# Altium schematic sheet Driver4BusV1.1.SchDoc: Adapterkarte 68-50polig mit Strobegenerator
size A2; PageSetup: Record=PageOptions|CenterHorizontal=True|CenterVertical=True|PrintScale=0.50|XCorrection=1.00|YCorrection=1.00|PrintKind=0|BorderSize=5000000|LeftOffset=0|BottomOffset=0|Orientation=2|PaperLength=2970|PaperWidth=2100|Scale=100|PaperSource=1|PrintQuality=-3|MediaType=1|DitherType=10|PaperKind=A4|PrintScaleMode=1
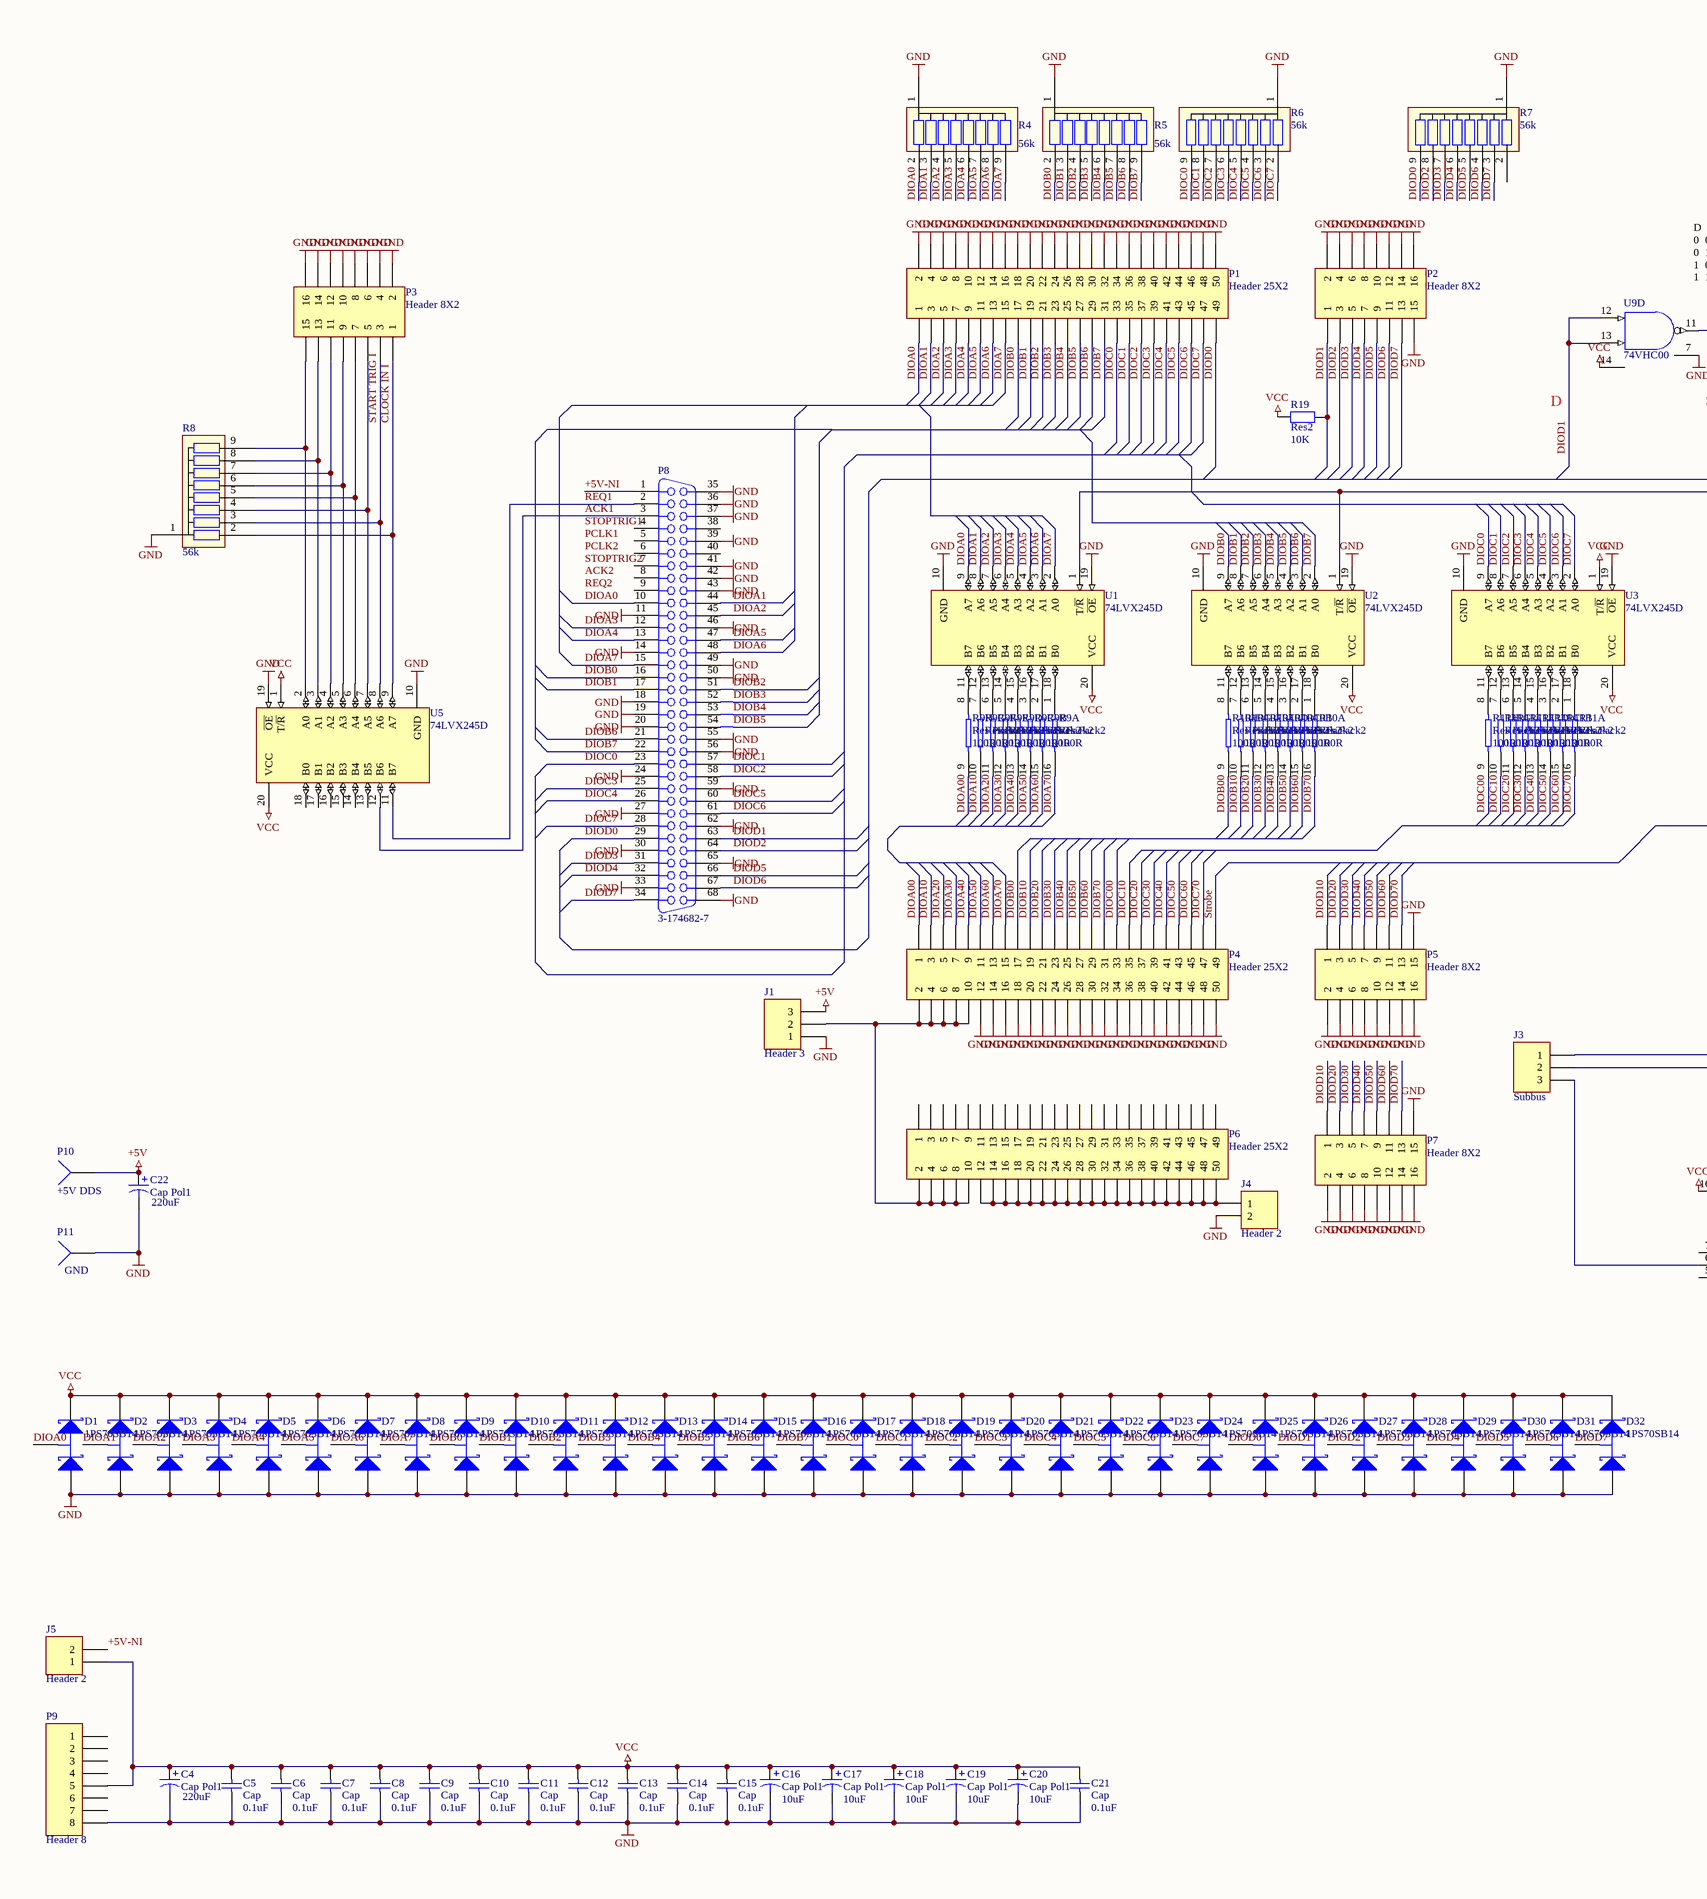
[diagram p0: Driver4BusV1.1.SchDoc, left]
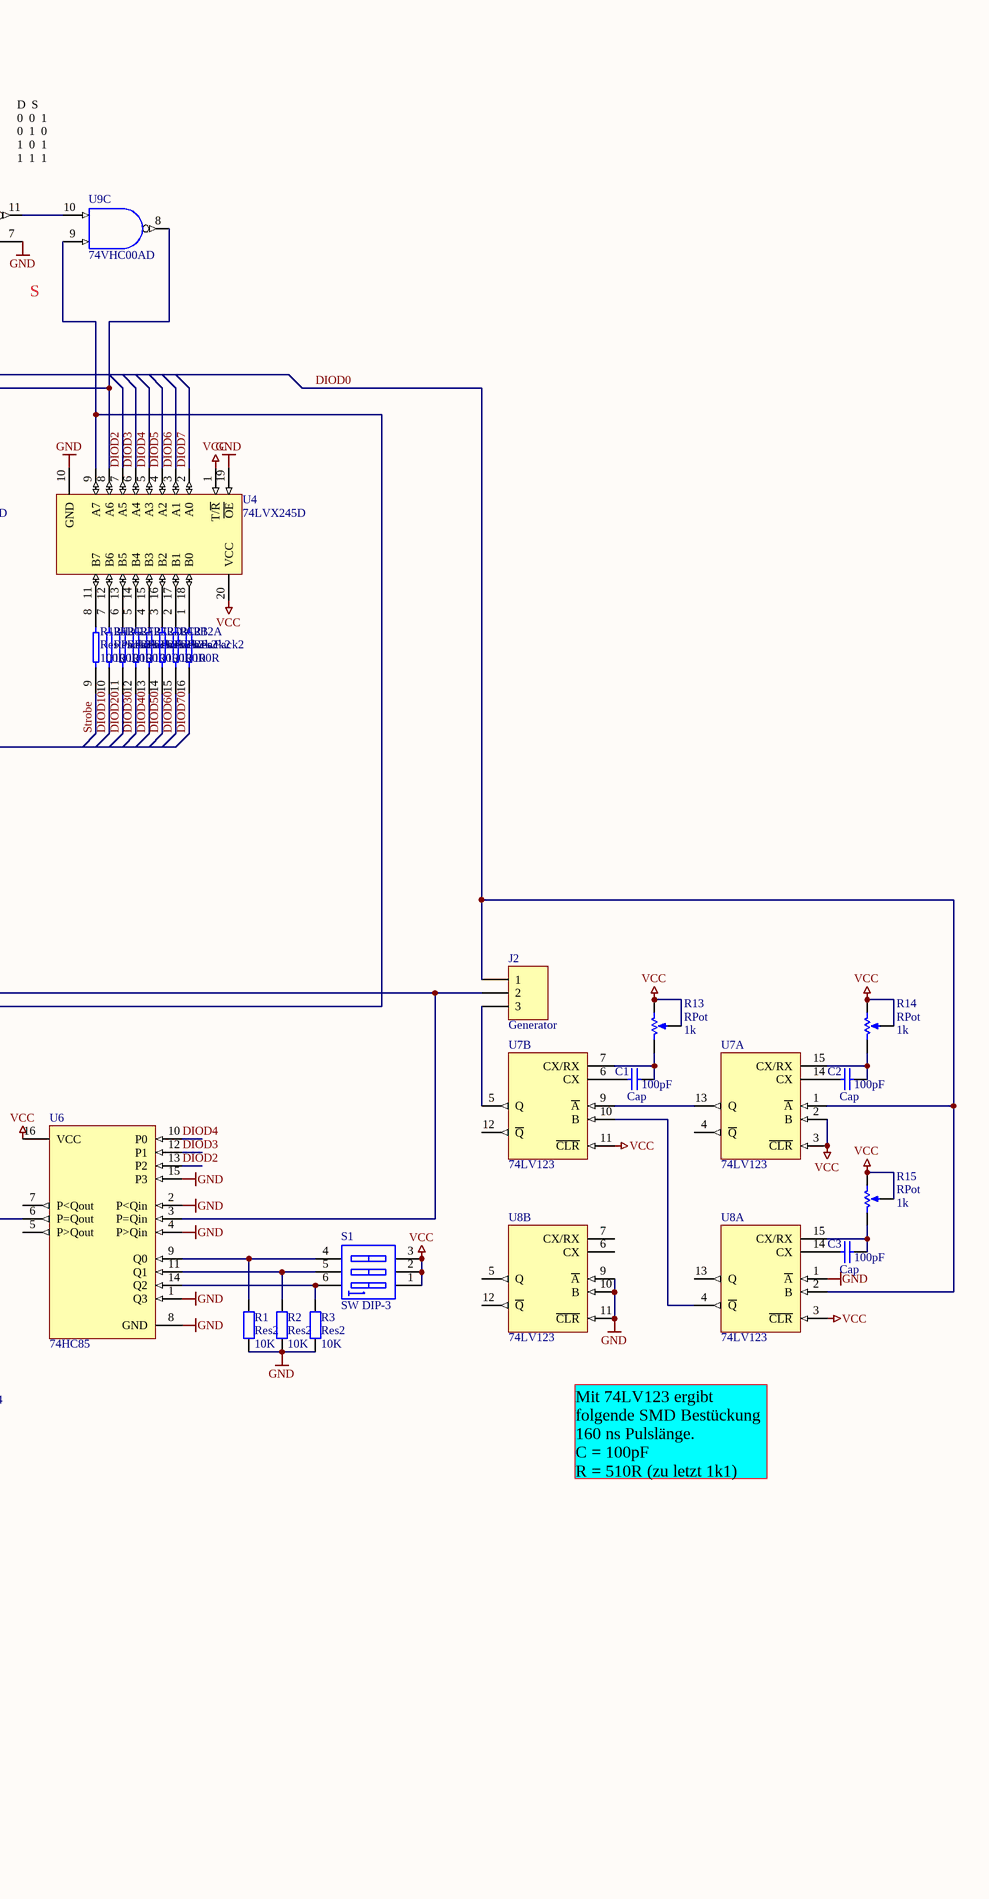
[diagram p1: Driver4BusV1.1.SchDoc, right]

## Parts
C1  Cap  value 100pF  [CAPC3216M]
C2  Cap  value 100pF  [CAPC3216M]
C3  Cap  value 100pF  [CAPC3216M]
C4  Cap Pol1  value 220uF  [ElkoSMD8]
C5  Cap  value 0.1uF  [CAPC3216M]
C6  Cap  value 0.1uF  [CAPC3216M]
C7  Cap  value 0.1uF  [CAPC3216M]
C8  Cap  value 0.1uF  [CAPC3216M]
C9  Cap  value 0.1uF  [CAPC3216M]
C10  Cap  value 0.1uF  [CAPC3216M]
C11  Cap  value 0.1uF  [CAPC3216M]
C12  Cap  value 0.1uF  [CAPC3216M]
C13  Cap  value 0.1uF  [CAPC3216M]
C14  Cap  value 0.1uF  [CAPC3216M]
C15  Cap  value 0.1uF  [CAPC3216M]
C16  Cap Pol1  value 10uF  [TC3528-1411]
C17  Cap Pol1  value 10uF  [TC3528-1411]
C18  Cap Pol1  value 10uF  [TC3528-1411]
C19  Cap Pol1  value 10uF  [TC3528-1411]
C20  Cap Pol1  value 10uF  [TC3528-1411]
C21  Cap  value 0.1uF  [CAPC3216M]
C22  Cap Pol1  value 220uF  [ElkoSMD8]
D1  1PS70SB14  [SOT323]
D2  1PS70SB14  [SOT323]
D3  1PS70SB14  [SOT323]
D4  1PS70SB14  [SOT323]
D5  1PS70SB14  [SOT323]
D6  1PS70SB14  [SOT323]
D7  1PS70SB14  [SOT323]
D8  1PS70SB14  [SOT323]
D9  1PS70SB14  [SOT323]
D10  1PS70SB14  [SOT323]
D11  1PS70SB14  [SOT323]
D12  1PS70SB14  [SOT323]
D13  1PS70SB14  [SOT323]
D14  1PS70SB14  [SOT323]
D15  1PS70SB14  [SOT323]
D16  1PS70SB14  [SOT323]
D17  1PS70SB14  [SOT323]
D18  1PS70SB14  [SOT323]
D19  1PS70SB14  [SOT323]
D20  1PS70SB14  [SOT323]
D21  1PS70SB14  [SOT323]
D22  1PS70SB14  [SOT323]
D23  1PS70SB14  [SOT323]
D24  1PS70SB14  [SOT323]
D25  1PS70SB14  [SOT323]
D26  1PS70SB14  [SOT323]
D27  1PS70SB14  [SOT323]
D28  1PS70SB14  [SOT323]
D29  1PS70SB14  [SOT323]
D30  1PS70SB14  [SOT323]
D31  1PS70SB14  [SOT323]
D32  1PS70SB14  [SOT323]
J1  Header 3  [HDR1X3]
J2  Generator  [HDR1X3]
J3  Subbus  [HDR1X3]
J4  Header 2  [RESC2012M]
J5  Header 2  [RESC2012M]
P1  Header 25X2  [HDR2X25]
P2  Header 8X2  [HDR2X8]
P3  Header 8X2  [HDR2X8]
P4  Header 25X2  [HDR2X25]
P5  Header 8X2  [HDR2X8]
P6  Header 25X2  [HDR2X25]
P7  Header 8X2  [HDR2X8]
P8  3-174682-7  [174225-5]
P9  Header 8  [DIN 8-polig V2]
P10  +5V DDS  [Banane on BCP]
P11  GND  [Banane on BCP]
R1  Res2  value 10K  [3216[1206]]
R2  Res2  value 10K  [3216[1206]]
R3  Res2  value 10K  [3216[1206]]
R4  value 56k  [Widerstandnetzwerk 4609X]  (hidden comment: Widerstandnetzwerk 4609X)
R5  value 56k  [Widerstandnetzwerk 4609X]  (hidden comment: Widerstandnetzwerk 4609X)
R6  value 56k  [Widerstandnetzwerk 4609X]  (hidden comment: Widerstandnetzwerk 4609X)
R7  value 56k  [Widerstandnetzwerk 4609X]  (hidden comment: Widerstandnetzwerk 4609X)
R8  value 56k  [Widerstandnetzwerk 4609X]  (hidden comment: Widerstandnetzwerk 4609X)
R9  Res Pack2  value 100R  [SOIC-OE16_M]  (parts A,B,C,D,E,F,G,H of 8)
R10  Res Pack2  value 100R  [SOIC-OE16_M]  (parts A,B,C,D,E,F,G,H of 8)
R11  Res Pack2  value 100R  [SOIC-OE16_M]  (parts A,B,C,D,E,F,G,H of 8)
R12  Res Pack2  value 100R  [SOIC-OE16_M]  (parts A,B,C,D,E,F,G,H of 8)
R13  RPot  value 1k  [rpot3]
R14  RPot  value 1k  [rpot3]
R15  RPot  value 1k  [rpot3]
R19  Res2  value 10K  [3216[1206]]
S1  SW DIP-3  [DIP-6]
U1  74LVX245D  [DW020_N]
U2  74LVX245D  [DW020_N]
U3  74LVX245D  [DW020_N]
U4  74LVX245D  [DW020_N]
U5  74LVX245D  [DW020_N]
U6  74HC85  [SO16_M]
U7  74LV123  [SO16_N]  (parts A,B of 2)
U8  74LV123  [SO16_N]  (parts A,B of 2)
U9  74VHC00AD  [751A-02_N]  (parts C,D of 4)

## Nets
+5V: C22.1 J1.3 P10.1
GND: C4.2 C5.1 C6.1 C7.1 C8.1 C9.1 C10.1 C11.1 C12.1 C13.1 C14.1 C15.1 C16.2 C17.2 C18.2 C19.2 C20.2 C21.1 C22.2 D1.1(A) D2.1(A) D3.1(A) D4.1(A) D5.1(A) D6.1(A) D7.1(A) D8.1(A) D9.1(A) D10.1(A) D11.1(A) D12.1(A) D13.1(A) D14.1(A) D15.1(A) D16.1(A) D17.1(A) D18.1(A) D19.1(A) D20.1(A) D21.1(A) D22.1(A) D23.1(A) D24.1(A) D25.1(A) D26.1(A) D27.1(A) D28.1(A) D29.1(A) D30.1(A) D31.1(A) D32.1(A) J1.1 J4.2 P1.2 P1.4 P1.6 P1.8 P1.10 P1.12 P1.14 P1.16 P1.18 P1.20 P1.22 P1.24 P1.26 P1.28 P1.30 P1.32 P1.34 P1.36 P1.38 P1.40 P1.42 P1.44 P1.46 P1.48 P1.50 P2.2 P2.4 P2.6 P2.8 P2.10 P2.12 P2.14 P2.15 P2.16 P3.2 P3.4 P3.6 P3.8 P3.10 P3.12 P3.14 P3.16 P4.12 P4.14 P4.16 P4.18 P4.20 P4.22 P4.24 P4.26 P4.28 P4.30 P4.32 P4.34 P4.36 P4.38 P4.40 P4.42 P4.44 P4.46 P4.48 P4.50 P5.2 P5.4 P5.6 P5.8 P5.10 P5.12 P5.14 P5.15 P5.16 P7.2 P7.4 P7.6 P7.8 P7.10 P7.12 P7.14 P7.15 P7.16 P8.11 P8.14 P8.18 P8.19 P8.20 P8.24 P8.27 P8.30 P8.33 P8.35 P8.36 P8.37 P8.39 P8.41 P8.42 P8.43 P8.46 P8.49 P8.50 P8.55 P8.56 P8.59 P8.62 P8.65 P8.68 P9.8 P11.1 R1.1 R2.1 R3.1 R4.1 R5.1 R6.1 R7.1 R8.1 U1.10(GND) U1.19(~{OE}) U2.10(GND) U2.19(~{OE}) U3.10(GND) U3.19(~{OE}) U4.10(GND) U4.19(~{OE}) U5.10(GND) U5.19(~{OE}) U6.1(Q3) U6.2(P<Qin) U6.4(P>Qin) U6.8(GND) U6.15(P3) U7.8(GND) U8.1(~{A}) U8.8(GND) U8.9(~{A}) U8.10(B) U8.11(~{CLR}) U9.7(GND)
VCC: C4.1 C5.2 C6.2 C7.2 C8.2 C9.2 C10.2 C11.2 C12.2 C13.2 C14.2 C15.2 C16.1 C17.1 C18.1 C19.1 C20.1 C21.2 D1.2(K) D2.2(K) D3.2(K) D4.2(K) D5.2(K) D6.2(K) D7.2(K) D8.2(K) D9.2(K) D10.2(K) D11.2(K) D12.2(K) D13.2(K) D14.2(K) D15.2(K) D16.2(K) D17.2(K) D18.2(K) D19.2(K) D20.2(K) D21.2(K) D22.2(K) D23.2(K) D24.2(K) D25.2(K) D26.2(K) D27.2(K) D28.2(K) D29.2(K) D30.2(K) D31.2(K) D32.2(K) J5.1 P9.5 R13.2(TAP) R13.3(TOP) R14.2(TAP) R14.3(TOP) R15.2(TAP) R15.3(TOP) R19.2 S1.1(A1) S1.2(A2) S1.3(A3) U1.20(VCC) U2.20(VCC) U3.1(T/~{R}) U3.20(VCC) U4.1(T/~{R}) U4.20(VCC) U5.1(T/~{R}) U5.20(VCC) U6.16(VCC) U7.2(B) U7.3(~{CLR}) U7.11(~{CLR}) U7.16(VCC) U8.3(~{CLR}) U8.16(VCC) U9.14(VDD)  [also labelled VDD]
+5V-NI: J5.2 P8.1
ACK1: P8.3 U5.12(B6)
CLOCK IN I: P3.1 R8.2 U5.9(A7)
DIOA0: D1.3(C) P1.1 P8.10 R4.2 U1.9(A7)
DIOA00: P4.1 R9.9
DIOA1: D2.3(C) P1.3 P8.44 R4.3 U1.8(A6)
DIOA2: D3.3(C) P1.5 P8.45 R4.4 U1.7(A5)
DIOA3: D4.3(C) P1.7 P8.12 R4.5 U1.6(A4)
DIOA4: D5.3(C) P1.9 P8.13 R4.6 U1.5(A3)
DIOA5: D6.3(C) P1.11 P8.47 R4.7 U1.4(A2)
DIOA6: D7.3(C) P1.13 P8.48 R4.8 U1.3(A1)
DIOA7: D8.3(C) P1.15 P8.15 R4.9 U1.2(A0)
DIOA10: P4.3 R9.10
DIOA20: P4.5 R9.11
DIOA30: P4.7 R9.12
DIOA40: P4.9 R9.13
DIOA50: P4.11 R9.14
DIOA60: P4.13 R9.15
DIOA70: P4.15 R9.16
DIOB0: D9.3(C) P1.17 P8.16 R5.2 U2.9(A7)
DIOB00: P4.17 R10.9
DIOB1: D10.3(C) P1.19 P8.17 R5.3 U2.8(A6)
DIOB2: D11.3(C) P1.21 P8.51 R5.4 U2.7(A5)
DIOB3: D12.3(C) P1.23 P8.52 R5.5 U2.6(A4)
DIOB4: D13.3(C) P1.25 P8.53 R5.6 U2.5(A3)
DIOB5: D14.3(C) P1.27 P8.54 R5.7 U2.4(A2)
DIOB6: D15.3(C) P1.29 P8.21 R5.8 U2.3(A1)
DIOB7: D16.3(C) P1.31 P8.22 R5.9 U2.2(A0)
DIOB10: P4.19 R10.10
DIOB20: P4.21 R10.11
DIOB30: P4.23 R10.12
DIOB40: P4.25 R10.13
DIOB50: P4.27 R10.14
DIOB60: P4.29 R10.15
DIOB70: P4.31 R10.16
DIOC0: D17.3(C) P1.33 P8.23 R6.9 U3.9(A7)
DIOC00: P4.33 R11.9
DIOC1: D18.3(C) P1.35 P8.57 R6.8 U3.8(A6)
DIOC2: D19.3(C) P1.37 P8.58 R6.7 U3.7(A5)
DIOC3: D20.3(C) P1.39 P8.25 R6.6 U3.6(A4)
DIOC4: D21.3(C) P1.41 P8.26 R6.5 U3.5(A3)
DIOC5: D22.3(C) P1.43 P8.60 R6.4 U3.4(A2)
DIOC6: D23.3(C) P1.45 P8.61 R6.3 U3.3(A1)
DIOC7: D24.3(C) P1.47 P8.28 R6.2 U3.2(A0)
DIOC10: P4.35 R11.10
DIOC20: P4.37 R11.11
DIOC30: P4.39 R11.12
DIOC40: P4.41 R11.13
DIOC50: P4.43 R11.14
DIOC60: P4.45 R11.15
DIOC70: P4.47 R11.16
DIOD0: D25.3(C) J2.1 P1.49 P8.29 R7.9 U7.1(~{A}) U8.2(B)
DIOD1: D26.3(C) P2.1 P8.63 R19.1 U9.12(A) U9.13(B)
DIOD2: D27.3(C) P2.3 P8.64 R7.8 U4.7(A5) U6.13(P2)
DIOD3: D28.3(C) P2.5 P8.31 R7.7 U4.6(A4) U6.12(P1)
DIOD4: D29.3(C) P2.7 P8.32 R7.6 U4.5(A3) U6.10(P0)
DIOD5: D30.3(C) P2.9 P8.66 R7.5 U4.4(A2)
DIOD6: D31.3(C) P2.11 P8.67 R7.4 U4.3(A1)
DIOD7: D32.3(C) P2.13 P8.34 R7.3 U4.2(A0)
DIOD10: P5.1 P7.1 R12.10
DIOD20: P5.3 P7.3 R12.11
DIOD30: P5.5 P7.5 R12.12
DIOD40: P5.7 P7.7 R12.13
DIOD50: P5.9 P7.9 R12.14
DIOD60: P5.11 P7.11 R12.15
DIOD70: P5.13 P7.13 R12.16
REQ1: P8.2 U5.11(B7)
START TRIG I: P3.3 R8.3 U5.8(A6)
Strobe: P4.49 R12.9
NetC1_1: C1.1 U7.6(CX)
NetC1_2: C1.2 R13.1(BOT) U7.7(CX/RX)
NetC2_1: C2.1 U7.14(CX)
NetC2_2: C2.2 R14.1(BOT) U7.15(CX/RX)
NetC3_1: C3.1 R15.1(BOT) U8.15(CX/RX)
NetC3_2: C3.2 U8.14(CX)
NetJ1_2: J1.2 P4.2 P4.4 P4.6 P4.8 P4.10 P6.2 P6.4 P6.6 P6.8 P6.10
NetJ2_2: J2.2 J3.1 U6.3(P=Qin)
NetJ2_3: J2.3 U7.5(Q)
NetJ3_2: J3.2 U4.9(A7) U9.9(A)
NetJ3_3: J3.3 U6.6(P=Qout)
NetJ4_1: J4.1 P6.12 P6.14 P6.16 P6.18 P6.20 P6.22 P6.24 P6.26 P6.28 P6.30 P6.32 P6.34 P6.36 P6.38 P6.40 P6.42 P6.44 P6.46 P6.48 P6.50
NetP3_5: P3.5 R8.4 U5.7(A5)
NetP3_7: P3.7 R8.5 U5.6(A4)
NetP3_9: P3.9 R8.6 U5.5(A3)
NetP3_11: P3.11 R8.7 U5.4(A2)
NetP3_13: P3.13 R8.8 U5.3(A1)
NetP3_15: P3.15 R8.9 U5.2(A0)
NetR1_2: R1.2 S1.4(B3) U6.9(Q0)
NetR2_2: R2.2 S1.5(B2) U6.11(Q1)
NetR3_2: R3.2 S1.6(B1) U6.14(Q2)
NetR9_1: R9.1 U1.18(B0)
NetR9_2: R9.2 U1.17(B1)
NetR9_3: R9.3 U1.16(B2)
NetR9_4: R9.4 U1.15(B3)
NetR9_5: R9.5 U1.14(B4)
NetR9_6: R9.6 U1.13(B5)
NetR9_7: R9.7 U1.12(B6)
NetR9_8: R9.8 U1.11(B7)
NetR10_1: R10.1 U2.18(B0)
NetR10_2: R10.2 U2.17(B1)
NetR10_3: R10.3 U2.16(B2)
NetR10_4: R10.4 U2.15(B3)
NetR10_5: R10.5 U2.14(B4)
NetR10_6: R10.6 U2.13(B5)
NetR10_7: R10.7 U2.12(B6)
NetR10_8: R10.8 U2.11(B7)
NetR11_1: R11.1 U3.18(B0)
NetR11_2: R11.2 U3.17(B1)
NetR11_3: R11.3 U3.16(B2)
NetR11_4: R11.4 U3.15(B3)
NetR11_5: R11.5 U3.14(B4)
NetR11_6: R11.6 U3.13(B5)
NetR11_7: R11.7 U3.12(B6)
NetR11_8: R11.8 U3.11(B7)
NetR12_1: R12.1 U4.18(B0)
NetR12_2: R12.2 U4.17(B1)
NetR12_3: R12.3 U4.16(B2)
NetR12_4: R12.4 U4.15(B3)
NetR12_5: R12.5 U4.14(B4)
NetR12_6: R12.6 U4.13(B5)
NetR12_7: R12.7 U4.12(B6)
NetR12_8: R12.8 U4.11(B7)
NetU1_1: U1.1(T/~{R}) U2.1(T/~{R}) U4.8(A6) U9.8(Y)
NetU7_9: U7.9(~{A}) U7.13(Q)
NetU7_10: U7.10(B) U8.4(~{Q})
NetU9_10: U9.10(B) U9.11(Y)

Not connected (* = marked no-connect by the designer): P6 1 3 5 7 9 11 13 15 17 19 21 23 25 27 29 31 33 35 37 39 41 43 45 47 49; P8 4 5 6 7 8 9 38 40; P9 1 2 3 4 6 7; R7 2; U5 13(B5) 14(B4) 15(B3) 16(B2) 17(B1) 18(B0); U6 5(P>Qout) 7(P<Qout); U7 4(~{Q}) 12(~{Q}); U8 5(Q) 6(CX) 7(CX/RX) 12(~{Q}) 13(Q)

## Notes on the sheet
- (near U9) D  S
  0  0  1
  0  1  0
  1  0  1
  1  1  1
- D
- S
- Mit 74LV123 ergibt folgende SMD Bestückung 160 ns Pulslänge.
  C = 100pF
  R = 510R (zu letzt 1k1)
- Labels drawn without touching a wire or pin: ACK2, PCLK1, PCLK2, REQ2, STOPTRIG1, STOPTRIG2

## Library data of the parts
C1-C3 C5-C15 C21 = Cap: Capacitor; Published: 8-Jun-2000; LatestRevisionDate: 17-Jul-2002; LatestRevisionNote: Re-released for DXP Platform.; Publisher: Altium Limited
C4 C16-C20 = Cap Pol1: Polarized Capacitor (Radial); Published: 8-Jun-2000; LatestRevisionDate: 17-Jul-2002; LatestRevisionNote: Re-released for DXP Platform.; Publisher: Altium Limited
  C16-C20: PackageReference: RB7.6-15
C22 = Cap Pol1: Polarized Capacitor (Radial); Voltage: 25V; Published: 8-Jun-2000; LatestRevisionDate: 17-Jul-2002; LatestRevisionNote: Re-released for DXP Platform.; Publisher: Altium Limited
D1-D32 = 1PS70SB14: Schottky Barrier Double Diode; Published: 17-Sep-2003; DatasheetDocument: 26-Apr-1999; PackageDocument: Apr-1999; PackageReference: SOT323; Publisher: Altium Limited
J1-J3 = Header 3: Header, 3-Pin; LatestRevisionDate: 17-Jul-2002; LatestRevisionNote: Re-released for DXP Platform.; Publisher: Altium Limited
J4 J5 = Header 2: Header, 2-Pin; LatestRevisionDate: 17-Jul-2002; LatestRevisionNote: Re-released for DXP Platform.; Publisher: Altium Limited
P1 P4 P6 = Header 25X2: Header, 25-Pin, Dual row; LatestRevisionDate: 17-Jul-2002; LatestRevisionNote: Re-released for DXP Platform.; Publisher: Altium Limited
P2 P3 P5 P7 = Header 8X2: Header, 8-Pin, Dual row; LatestRevisionDate: 17-Jul-2002; LatestRevisionNote: Re-released for DXP Platform.; Publisher: Altium Limited
P8 = 3-174682-7: Plug Assembly, Horizontal with Kink; Positions: 68; Note: Series I; Gender: Receptacle Header; Note: Without Mating Lock; PCB_Layout: Complies with manufacturer's recommendation.; DrillSize: Corresponds to nominal value.; Published: 17-Jul-2002; DatasheetDocument: 29-Mar-1991; PackageDocument: 29-Mar-1991; PackageReference: 3-174682-7; Publisher: Altium Limited; Orientation: Right Angle
P9 = Header 8: Header, 8-Pin; Reichelt: MABP 8SN; LatestRevisionDate: 17-Jul-2002; LatestRevisionNote: Re-released for DXP Platform.; Publisher: Altium Limited
P10 P11 = Socket: LatestRevisionDate: 17-Jul-2002; LatestRevisionNote: Re-released for DXP Platform.; Publisher: Altium Limited
R1-R3 R19 = Res2: Resistor; Published: 8-Jun-2000; LatestRevisionDate: 17-Jul-2002; LatestRevisionNote: Re-released for DXP Platform.; Publisher: Altium Limited
  R1-R3: PackageReference: AXIAL-0.4
R9-R12 = Res Pack2: Isolated Resistor Network - Parts; Sim Note: Enter the Resistance value into parameter field.; Published: 24-Mar-1999; LatestRevisionDate: 17-Jul-2002; LatestRevisionNote: Re-released for DXP Platform.; Publisher: Altium Limited; Code_JEDEC: MO-001-AC
R13-R15 = RPot: Potentiometer; Sim Note: Enter the Resistance value and the set point into parameter fields.; Set Position: 0.5; Published: 8-Jun-2000; LatestRevisionDate: 17-Jul-2002; LatestRevisionNote: Re-released for DXP Platform.; Publisher: Altium Limited
S1 = SW DIP-3: DIP Switch, 3 Position, SPST; Published: 24-Mar-1999; LatestRevisionDate: 17-Jul-2002; LatestRevisionNote: Re-released for DXP Platform.; PackageReference: DIP-6; Publisher: Altium Limited; Code_JEDEC: MO-001-AM
U1-U5 = SN74HC245DW: Octal Bus Transceiver with 3-State Outputs; Published: 8-Jun-2000; LatestRevisionDate: 13-Apr-2006; LatestRevisionNote: IPC-7351 Footprint Added.; DatasheetVersion: May-1997; PackageVersion: Mar-2000; PackageReference: DW020; Publisher: Altium Limited; PackageDescription: 20-Pin Plastic Small Outline Integrated Circuit 1.27 mm Pitch; Code_JEDEC: MS-013; Code_IPC: SOIC127P1030-20; ComponentLink1Description: Manufacturer Link; ComponentLink1URL: http://www.ti.com/; ComponentLink2Description: Datasheet; ComponentLink2URL: http://www-s.ti.com/sc/ds/sn74hc245.pdf
U6 = M74HC85M1R: 4-Bit Magnitude Comparator; Published: 8-Jun-2000; LatestRevisionDate: 13-Apr-2006; LatestRevisionNote: IPC-7351 Footprint Added.; DatasheetVersion: Dec-1992; PackageVersion: May-1998; PackageReference: SO16; Publisher: Altium Limited; PackageDescription: 16-Pin Small Outline Integrated Circuit 1.27 mm Pitch; Code_IPC: SOIC127P600-16; ComponentLink1Description: Manufacturer Link; ComponentLink1URL: http://www.st.com/; ComponentLink2Description: Datasheet; ComponentLink2URL: http://www.st.com/stonline/products/literature/ds/2005/m74hc85.pdf
U7 U8 = M74HC123AM1R: Dual Retriggerable Monostable Multivibrator; Published: 8-Jun-2000; LatestRevisionDate: 13-Apr-2006; LatestRevisionNote: IPC-7351 Footprint Added.; DatasheetVersion: Oct-1993; PackageVersion: May-1998; PackageReference: SO16; Publisher: Altium Limited; PackageDescription: 16-Pin Small Outline Integrated Circuit 1.27 mm Pitch; Code_IPC: SOIC127P600-16; ComponentLink1Description: Manufacturer Link; ComponentLink1URL: http://www.st.com/
U9 = MC74HC00AD: Quad 2-Input NAND Gate; Published: 17-Jul-2002; LatestRevisionDate: 13-Apr-2006; LatestRevisionNote: IPC-7351 Footprint Added.; DatasheetVersion: 1989; PackageVersion: 1991; PackageReference: 751A-02; Publisher: Altium Limited; PackageDescription: 14-Pin Small Outline Integrated Circuit 1.27 mm Pitch; Code_IPC: SOIC127P600-14; ComponentLink1Description: Manufacturer Link; ComponentLink1URL: http://www.onsemi.com/site/products/parametrics/0,4446,247,00.html; ComponentLink2Description: Ibis Model; ComponentLink2URL: http://www.onsemi.com/pub/Collateral/MC54HC00AJ.IBS